# Altium project USB DV Stick 1V1.PrjPCB
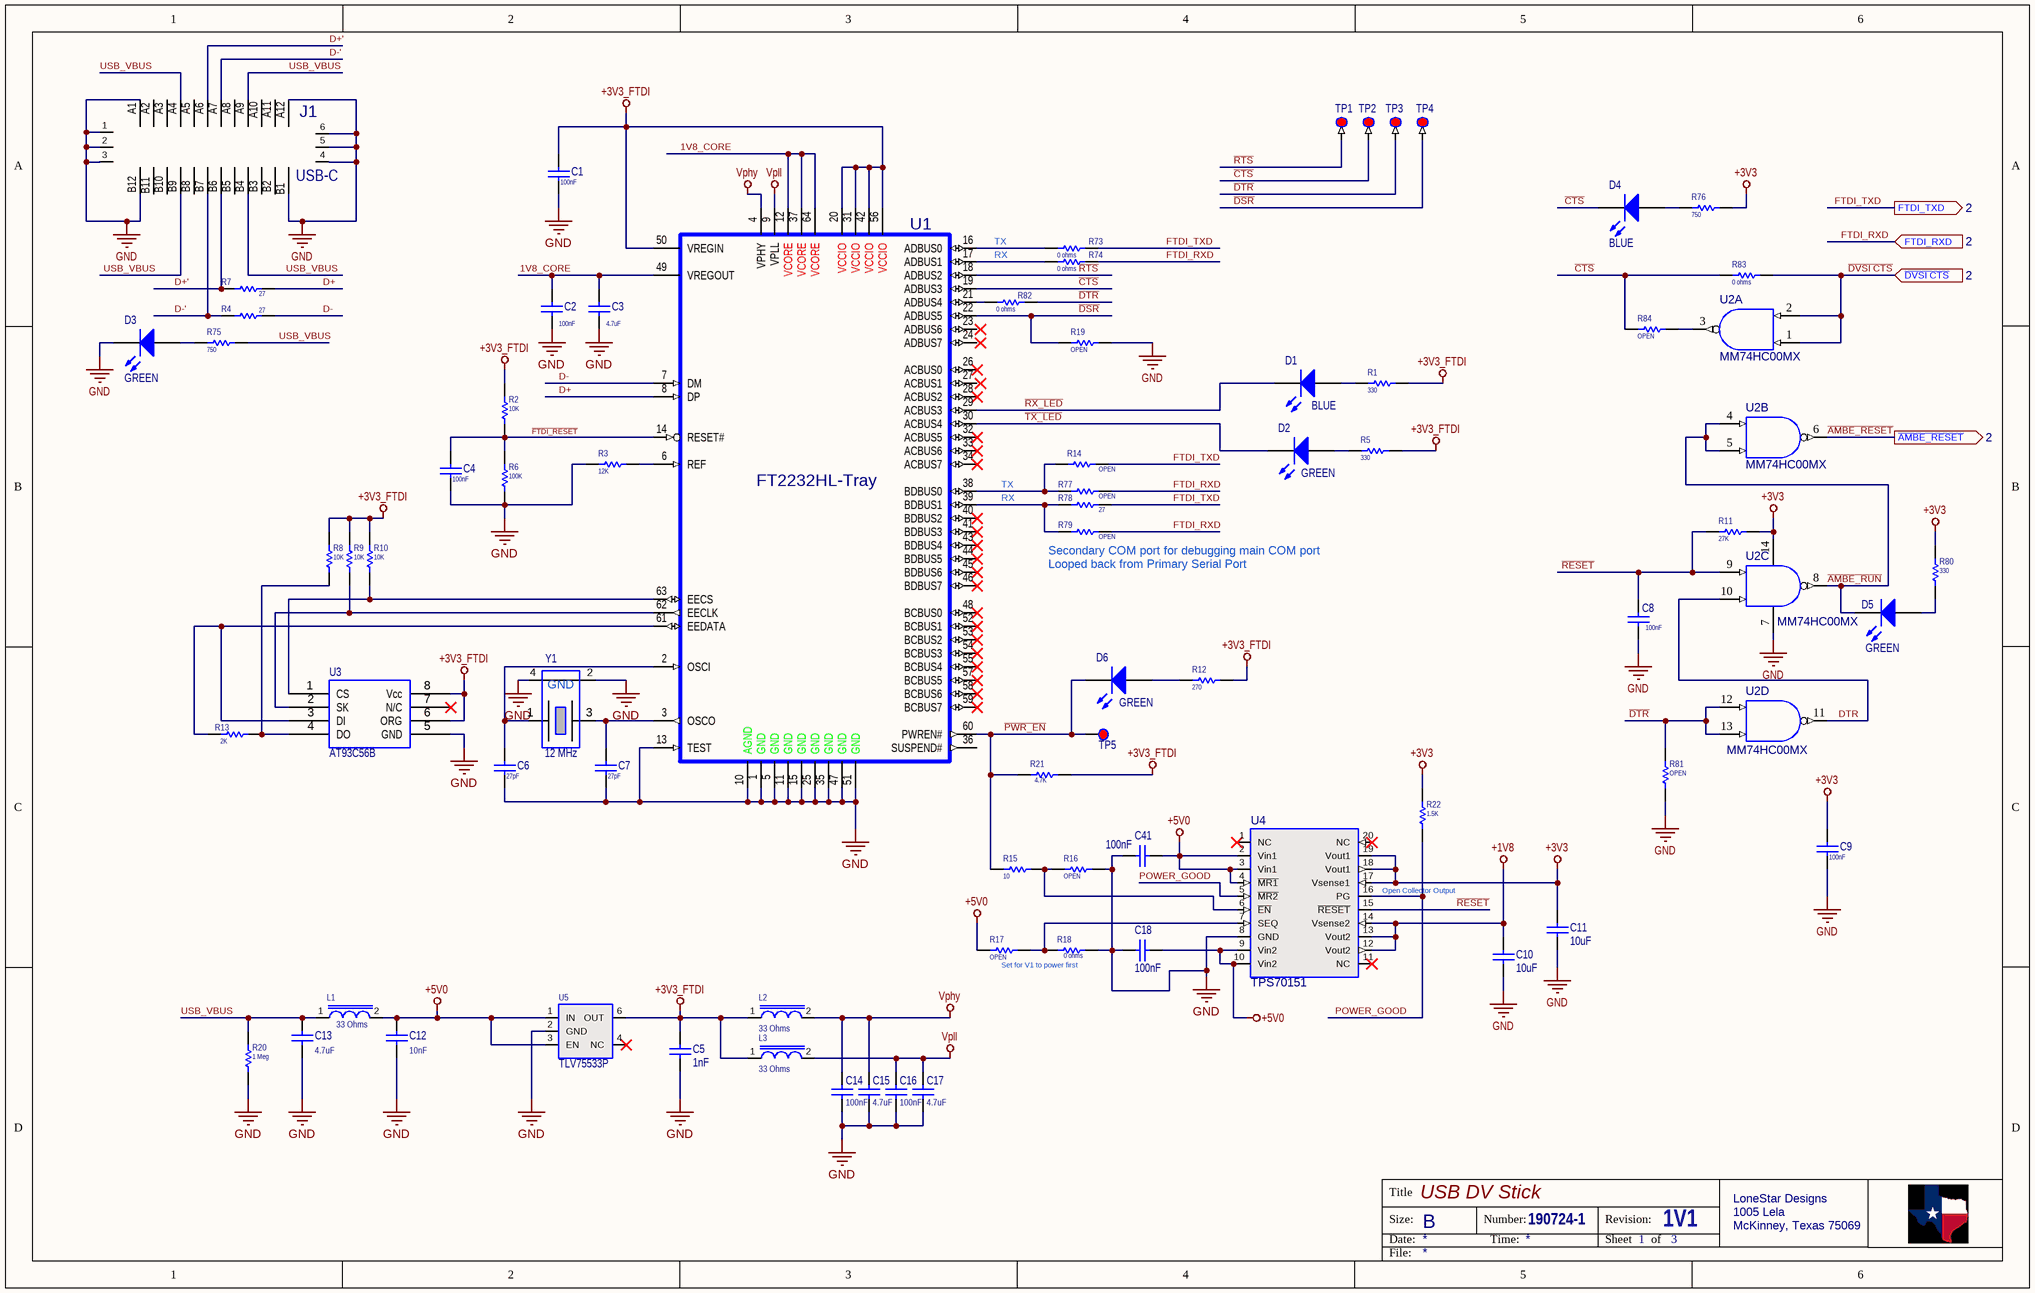
[diagram p0: USB DV Stick 1V1_Sheet1.SchDoc]
3 sheets, 158 parts. Net scope: global (net labels, ports and power ports of the same name join across sheets).
Board file: USB DV Stick 1V1.PcbDoc
Sheets:
  USB DV Stick 1V1_Sheet1.SchDoc
  USB DV Stick 1V1_Sheet2.SchDoc
  USB DV Stick 1V1_Sheet3.SchDoc

## Sheet USB DV Stick 1V1_Sheet1.SchDoc: USB DV Stick
size B; CompanyName: LoneStar Designs; Organization: LoneStar Designs; Address1: 1005 Lela; Address2: McKinney, Texas 75069; DocumentNumber: 190724-1; Revision: 1V1; SheetNumber: 1; SheetTotal: 3

### Parts
C1  100nF  [C0402]
C2  100nF  [C0402]
C3  4.7uF  [C0603]
C4  100nF  [C0402]
C5  1nF  [C0402]
C6  27pF  [C0402]
C7  27pF  [C0402]
C8  100nF  [C0402]
C9  100nF  [C0402]
C10  10uF  [C0805]
C11  10uF  [C0805]
C12  10nF  [C0402]
C13  4.7uF  [C0603]
C14  100nF  [C0402]
C15  4.7uF  [C0603]
C16  100nF  [C0402]
C17  4.7uF  [C0603]
C18  100nF  [C0402]
C41  100nF  [C0603]
D1  BLUE  [LED0603]
D2  GREEN  [LED0603]
D3  GREEN  [LED0603]
D4  BLUE  [LED0603]
D5  GREEN  [LED0603]
D6  GREEN  [LED0603]
J1  USB-C  [USB-C]
L1  33 Ohms  [C0603]
L2  33 Ohms  [C0603]
L3  33 Ohms  [C0603]
R1  330  [R0603]
R2  10K  [R0603]
R3  12K  [R0603]
R4  27  [R0603]
R5  330  [R0603]
R6  100K  [R0603]
R7  27  [R0603]
R8  10K  [R0603]
R9  10K  [R0603]
R10  10K  [R0603]
R11  27K  [R0603]
R12  270  [R0603]
R13  2K  [R0603]
R14  OPEN  [R0603]
R15  10  [R0603]
R16  OPEN  [R0603]
R17  OPEN  [R0603]
R18  0 ohms  [R0603]
R19  OPEN  [R0603]
R20  1 Meg  [R0603]
R21  4.7K  [R0603]
R22  1.5K  [R0603]
R73  0 ohms  [R0603]
R74  0 ohms  [R0603]
R75  750  [R0603]
R76  750  [R0603]
R77  OPEN  [R0603]
R78  27  [R0603]
R79  OPEN  [R0603]
R80  330  [R0603]
R81  OPEN  [R0603]
R82  0 ohms  [R0603]
R83  0 ohms  [R0603]
R84  OPEN  [R0603]
TP1  5015  [TP SM]  (value not drawn)
TP2  5015  [TP SM]  (value not drawn)
TP3  5015  [TP SM]  (value not drawn)
TP4  5015  [TP SM]  (value not drawn)
TP5  5015  [TP SM]  (value not drawn)
U1  FT2232HL-Tray  [FT2232HL]
U2  MM74HC00MX  [D014_L]  (parts A,B,C,D of 4)
U3  AT93C56B  [SO8_M]
U4  TPS70151  [TTSOP-20 (PW)]
U5  TLV75533P  [SOT23-6_M]
Y1  12 MHz  [OSC_ECS-TXO-2033]  (value not drawn)

### Ports
FTDI_RXD (in, see 2), FTDI_TXD (out, see 2), ~{AMBE_RESET} (out, see 2), ~{DVSI CTS} (in, see 2)

### Nets
+1V8: C10.2 U4.12(Vout2) U4.13(Vout2) U4.14(Vsense2)
+3V3: C9.2 C11.2 R11.1 R22.2 R76.2 R80.2 U2.14(VCC) U4.17(Vsense1) U4.18(Vout1) U4.19(Vout1)
+3V3_FTDI: C1.2 C5.2 L2.1 L3.1 R1.2 R2.2 R5.2 R8.2 R9.2 R10.2 R12.2 R21.1 U1.20(VCCIO) U1.31(VCCIO) U1.42(VCCIO) U1.50(VREGIN) U1.56(VCCIO) U3.6(ORG) U3.8(Vcc) U5.6(OUT)
+5V0: C12.2 C18.1 C41.2 L1.2 R17.1 U4.2(Vin1) U4.3(Vin1) U4.4(~{MR1}) U4.9(Vin2) U4.10(Vin2) U5.1(IN) U5.3(EN)
GND: C1.1 C2.1 C3.1 C4.1 C5.1 C6.1 C7.1 C8.1 C9.1 C10.1 C11.1 C12.1 C13.1 C14.1 C15.1 C16.1 C17.1 C18.2 C41.1 D3.2(K) J1.1 J1.2 J1.3 J1.4 J1.5 J1.6 J1.A1 J1.A12 J1.B1 J1.B12 R3.1 R6.1 R16.2 R18.2 R19.1 R20.1 R81.1 U1.1(GND) U1.5(GND) U1.10(AGND) U1.11(GND) U1.13(TEST) U1.15(GND) U1.25(GND) U1.35(GND) U1.47(GND) U1.51(GND) U2.7(GND) U3.5(GND) U4.8(GND) U5.2(GND) Y1.2(GND) Y1.4
Vphy: C14.2 C15.2 L2.2 U1.4(VPHY)
Vpll: C16.2 C17.2 L3.2 U1.9(VPLL)
1V8_CORE: C2.2 C3.2 U1.12(VCORE) U1.37(VCORE) U1.49(VREGOUT) U1.64(VCORE)
~{AMBE_RESET}: U2.6(Y) ; port ~{AMBE_RESET}
~{AMBE_RUN}: D5.2(K) U2.4(A) U2.5(B) U2.8(Y)
~{CTS}: D4.2(K) R83.1 R84.1 TP2.1 U1.19(ADBUS3)
~{DSR}: R19.2 TP4.1 U1.22(ADBUS5)
~{DTR}: R81.2 R82.2 TP3.1 U2.12(A) U2.13(B)
~{DVSI CTS}: R83.2 U2.1(A) U2.2(B) ; port ~{DVSI CTS}
~{FTDI_RESET}: C4.2 R2.1 R6.2 U1.14(RESET#)
~{PWR_EN}: D6.2(K) R15.1 R21.2 TP5.1 U1.60(PWREN#)
~{RESET}: C8.2 R11.2 U2.9(A) U4.15(~{RESET})
~{RTS}: TP1.1 U1.18(ADBUS2)
~{RX_LED}: D1.2(K) U1.29(ACBUS3)
~{TX_LED}: D2.2(K) U1.30(ACBUS4)
D+: R7.2 U1.8(DP)
D+': J1.A6 J1.B6 R7.1
D-: R4.2 U1.7(DM)
D-': J1.A7 J1.B7 R4.1
DTR: U2.10(B) U2.11(Y)
FTDI_RXD: R74.2 R77.2 R79.2 ; port FTDI_RXD
FTDI_TXD: R14.1 R73.2 R78.2 ; port FTDI_TXD
POWER_GOOD: R22.1 U4.5(~{MR2}) U4.16(PG)
USB_VBUS: C13.2 J1.A4 J1.A9 J1.B4 J1.B9 L1.1 R20.2 R75.2
NetC6_2: C6.2 U1.2(OSCI) Y1.1
NetC7_2: C7.2 U1.3(OSCO) Y1.3
NetD1_1: D1.1(A) R1.1
NetD2_1: D2.1(A) R5.1
NetD3_1: D3.1(A) R75.1
NetD4_1: D4.1(A) R76.1
NetD5_1: D5.1(A) R80.1
NetD6_1: D6.1(A) R12.1
NetR3_2: R3.2 U1.6(REF)
NetR8_1: R8.1 R13.2 U3.4(DO)
NetR9_1: R9.1 U1.62(EECLK) U3.2(SK)
NetR10_1: R10.1 U1.63(EECS) U3.1(CS)
NetR13_1: R13.1 U1.61(EEDATA) U3.3(DI)
NetR14_2: R14.2 R77.1 U1.38(BDBUS0)
NetR15_2: R15.2 R16.1 U4.6(~{EN})
NetR17_2: R17.2 R18.1 U4.7(SEQ)
NetR73_1: R73.1 U1.16(ADBUS0)
NetR74_1: R74.1 U1.17(ADBUS1)
NetR78_1: R78.1 R79.1 U1.39(BDBUS1)
NetR82_1: R82.1 U1.21(ADBUS4)
NetR84_2: R84.2 U2.3(Y)

Not connected (* = marked no-connect by the designer): J1 A2 A3 A5 A8 A10 A11 B2 B3 B5 B8 B10 B11; U1 23(ADBUS6) 24(ADBUS7) 26(ACBUS0)* 27(ACBUS1) 28(ACBUS2)* 32(ACBUS5)* 33(ACBUS6)* 34(ACBUS7)* 36(SUSPEND#) 40(BDBUS2)* 41(BDBUS3)* 43(BDBUS4)* 44(BDBUS5)* 45(BDBUS6)* 46(BDBUS7)* 48(BCBUS0)* 52(BCBUS1)* 53(BCBUS2)* 54(BCBUS3)* 55(BCBUS4)* 57(BCBUS5)* 58(BCBUS6)* 59(BCBUS7)*; U3 7(N/C)*; U4 1(NC)* 11(NC)* 20(NC)*; U5 4(NC)*

### Notes on the sheet
- TX
- RX
- (near R79) Secondary COM port for debugging main COM port
- (near R79) Looped back from Primary Serial Port
- (near U4) Open Collector Output
- Set for V1 to power first
- Title
- Size:
- Date:
- B
- Number:
- Time:
- Revision:
- Sheet
- of
- File:

### Library data of the parts
C1 C2 C4 C8 C9 C14 C16 C18 = Cap SM: Capacitor Surface Mount; Manufacturer: Murata Electronics; Manufacturer Part Number: GRM155R61H104KE19D; PackageReference: C0603; PackageDescription: Chip Capacitor; Value: 100nF; Supplier 1: Mouser; Supplier Part Number 1: 81-GRM155R61H104KE9D
C3 C13 C15 C17 = Cap SM: Capacitor Surface Mount; Manufacturer: Taiyo Yuden; Manufacturer Part Number: TMK107BBJ475MA-T; PackageReference: C0603; PackageDescription: Chip Capacitor; Value: 4.7uF; Supplier 1: Mouser; Supplier Part Number 1: 963-TMK107BBJ475MA-T
C5 = Cap SM: Capacitor Surface Mount; Manufacturer: Murata Electronics; Manufacturer Part Number: GCM1555C1H102JA16J; PackageReference: C0402; PackageDescription: Chip Capacitor; Value: 1nF; Supplier 1: Mouser; Supplier Part Number 1: 81-GCM1555C1H102JA6J
C6 C7 = Cap SM: Capacitor Surface Mount; Manufacturer: Murata Electronics; Manufacturer Part Number: GCM1555C1H270FA16D; PackageReference: C0603; PackageDescription: Chip Capacitor; Value: 27pF; Supplier 1: Mouser; Supplier Part Number 1: 81-GCM1555C1H270FA6D
C10 C11 = Cap SM: Capacitor Surface Mount; Manufacturer: Murata Electronics; Manufacturer Part Number: GRJ21BR61E106KE01K; PackageReference: C0603; PackageDescription: Chip Capacitor; Value: 10uF; Supplier 1: Mouser; Supplier Part Number 1: 81-GRJ21BR61E106KE1K
C12 = Cap SM: Capacitor Surface Mount; Manufacturer: Murata Electronics; Manufacturer Part Number: GCM155R71H103KA55D; PackageReference: C0402; PackageDescription: Chip Capacitor; Value: 10nF; Supplier 1: Mouser; Supplier Part Number 1: 81-GCM155R71H103KA5D
C41 = Cap SM: Capacitor Surface Mount; Manufacturer: Murata Electronics; Manufacturer Part Number: GRM033C71C104KE14D; LatestRevisionDate: 08/13/2019; LatestRevisionNote: IPC-7351 Footprint Added.; PackageReference: C0603; PackageDescription: Chip Capacitor; Value: 100nF; Supplier 1: Mouser; Supplier 1 Part Number: *; Supplier Part Number 1: 81-GRM33C71C104KE14D
D1 D4 = LED 0603 BLUE: BLUE in 0603 package; Manufacturer: Kingbright; Manufacturer Part Number: APT1608QBC/D; PackageDescription: SM LED; 0603 package; Supplier 1: Mouser; Supplier Part Number 1: 604-APT1608QBC/D; Value: BLUE; PackageReference: R0603
D2 D3 D5 D6 = LED 0603 GREEN: GREEN in 0603 package; Manufacturer: Kingbright; Manufacturer Part Number: APT1608CGCK; PackageDescription: SM LED; 0603 package; Supplier 1: Mouser; Supplier Part Number 1: 604-APT1608CGCK; Value: GREEN; PackageReference: R0603
J1 = USB-C ( through hole ): USB Type C with through holes; Manufacturer: Würth Elektronik; Manufacturer Part Number: 632 723 300 311; Supplier 1: Mouser; Supplier Part Number 1: 710-632723300011; Value: USB-C; PackageDescription: USB-C; PackageReference: USB-C
L1-L3 = Ferrite Bead ( 0603 ): Standard Ferrite Bead in 0603 package; Manufacturer: Taiyo Yuden; Manufacturer Part Number: BKP1608HS121-T; Value: 33 Ohms; Supplier 1: Mouser; Supplier Part Number 1: 963-BKP1608HS121-T; PackageDescription: Ferrite Bead; PackageReference: C0603
R1 R5 R80 = RES SM: Resistor Surface Mount; Manufacturer: Vishay / Dale; Manufacturer Part Number: CRCW0603330RFKEBC; PackageReference: R0603; PackageDescription: Surface Mount; Value: 330; Supplier 1: Mouser; Supplier Part Number 1: 71-CRCW0603330RFKEBC
R2 R8-R10 = RES SM: Resistor Surface Mount; Manufacturer: Vishay / Dale; Manufacturer Part Number: CRCW060310K0FKEAC; PackageReference: R0603; PackageDescription: Surface Mount; Value: 10K; Supplier 1: Mouser; Supplier Part Number 1: 71-CRCW060310K0FKEAC
R3 = RES SM: Resistor Surface Mount; Manufacturer: Vishay / Dale; Manufacturer Part Number: CRCW060312K1FKEAC; PackageReference: R0603; PackageDescription: Surface Mount; Value: 12K; Supplier 1: Mouser; Supplier Part Number 1: 71-CRCW060312K1FKEAC
R4 R7 R78 = RES SM: Resistor Surface Mount; Manufacturer: Vishay / Dale; Manufacturer Part Number: RCS060327R0FKEA; PackageReference: R0603; PackageDescription: Surface Mount; Value: 27; Supplier 1: Mouser; Supplier Part Number 1: 71-RCS060327R0FKEA
R6 = RES SM: Resistor Surface Mount; Manufacturer: Vishay / Dale; Manufacturer Part Number: CRCW0603100KJNEAC; PackageReference: R0603; PackageDescription: Surface Mount; Value: 100K; Supplier 1: Mouser; Supplier Part Number 1: 71-CRCW0603100KJNEAC
R11 = RES SM: Resistor Surface Mount; Manufacturer: Vishay / Dale; Manufacturer Part Number: CRCW060327K0FKEAC; PackageReference: R0603; PackageDescription: Surface Mount; Value: 27K; Supplier 1: Mouser; Supplier Part Number 1: 71-CRCW060327K0FKEAC
R12 = RES SM: Resistor Surface Mount; Manufacturer: Vishay / Dale; Manufacturer Part Number: RCS0603270RFKEA; PackageReference: R0603; PackageDescription: Surface Mount; Value: 270; Supplier 1: Mouser; Supplier Part Number 1: 71-RCS0603270RFKEA
R13 = RES SM: Resistor Surface Mount; Manufacturer: Vishay / Dale; Manufacturer Part Number: CRCW06032K00FKEAC; PackageReference: R0603; PackageDescription: Surface Mount; Value: 2K; Supplier 1: Mouser; Supplier Part Number 1: 71-CRCW06032K00FKEAC
R14 R16 R17 R19 R77 R79 R81 R84 = RES SM: Resistor Surface Mount; PackageReference: R0603; PackageDescription: Surface Mount; Value: OPEN; Manufacturer: N/A; Manufacturer Part Number: N/A; Supplier Part Number 1: N/A
  R14 R16 R17 R19 R77 R79 R81: Supplier 1: N/A
  R84: Supplier 1: Mouser
R15 = RES SM: Resistor Surface Mount; Manufacturer: Vishay / Dale; Manufacturer Part Number: CRCW060310R0FKEAC; PackageReference: R0603; PackageDescription: Surface Mount; Value: 10; Supplier 1: Mouser; Supplier Part Number 1: 71-CRCW060310R0FKEAC
R18 R73 R74 R82 R83 = RES SM: Resistor Surface Mount; Manufacturer: Vishay / Dale; Manufacturer Part Number: CRCW06030000Z0EAC; PackageReference: R0603; PackageDescription: Surface Mount; Value: 0 ohms; Supplier 1: Mouser; Supplier Part Number 1: 71-CRCW06030000Z0EAC
R20 = RES SM: Resistor Surface Mount; Manufacturer: Panasonic; Manufacturer Part Number: ERJ-3EKF1004V; PackageReference: R0603; PackageDescription: Surface Mount; Value: 1 Meg; Supplier 1: Mouser; Supplier Part Number 1: 667-ERJ-3EKF1004V
R21 = RES SM: Resistor Surface Mount; Manufacturer: Vishay / Dale; Manufacturer Part Number: CRCW06034K70FKEA; PackageReference: R0603; PackageDescription: Surface Mount; Value: 4.7K; Supplier 1: Mouser; Supplier Part Number 1: 71-CRCW0603-4.7K-E3
R22 = RES SM: Resistor Surface Mount; Manufacturer: Vishay / Dale; Manufacturer Part Number: CRCW06031K50FKEAC; PackageReference: R0603; PackageDescription: Surface Mount; Value: 1.5K; Supplier 1: Mouser; Supplier Part Number 1: 71-CRCW06031K50FKEAC
R75 R76 = RES SM: Resistor Surface Mount; Manufacturer: Vishay / Dale; Manufacturer Part Number: CRCW0603750RFKEA; PackageReference: R0603; PackageDescription: Surface Mount; Value: 750; Supplier 1: Mouser; Supplier Part Number 1: 71-CRCW0603-750-E3
TP1-TP5 = Test Point: Surface Mount; Manufacturer: Keystone; Value: TP SM; Manufacturer Part Number: 5015; Supplier 1: Mouser; Supplier 2: Digi-Key; Supplier Part Number 1: 534-5015; Supplier Part Number 2: 36-5015CT-ND; PackageDescription: R0805; PackageReference: R0805
U1 = FT2232HL-Tray: Dual High Speed USB To Multipurpose UART/FIFO IC, LQFP-64, Tray; Manufacturer: FTDI; PackageReference: LQFP-64; PackageDescription: 64-Pin Thin Quad Flat Pack, 10 x 10 x 1.4 mm Body, 0.5 mm Pitch; ComponentLink1Description: Manufacturer Link; ComponentLink1URL: http://www.ftdichip.com/Products/ICs/FT2232H.htm; ComponentLink2Description: Datasheet; Supplier 1: Mouser; Supplier 2: Digi-Key; Supplier Part Number 1: 895-FT2232HL-TRAY; Supplier Part Number 2: 768-1347-ND; Value: FT2232HL-TR; Manufacturer Part Number: FT2232HL-TRAY
U2 = 74AS00D: Quadruple 2-Input Positive-NAND Gate; Manufacturer: ON / Fairchild; PackageReference: SOIC-14 Narrow; PackageDescription: 14-Pin Small Outline Integrated Circuit 1.27 mm Pitch; ComponentLink1Description: Manufacturer Link; ComponentLink1URL: https://www.mouser.com/datasheet/2/149/MM74HC00-1011083.pdf; ComponentLink2Description: Datasheet; Value: MM74HC00MX; Supplier 1: Mouser; Manufacturer Part Number: MM74HC00MX; Supplier Part Number 1: 512-MM74HC00MX
U3 = AT93C56B: 2Kb ( 256 x 8 ) Serial Memory; Manufacturer: Microship Technology; Manufacturer Part Number: AT93C56B-SSHM-B; Supplier 1: Mouser; Supplier Part Number 1: 556-AT93C56B-SSHM-B; Value: AT93C56B; PackageDescription: SO-8; PackageReference: SO-8
U4 = TPS70151: Dual Output low drop out regulator; Manufacturer Part Number: TPS70151PWP; Manufacturer: TI; Value: TPS70151; Supplier 1: Mouser; Supplier Part Number 1: 595-TPS70151PWP; PackageDescription: HTTSOP-20; PackageReference: TTSOP-20
U5 = TLV755P: 3.3V LDO in SOT-23-5 package  ( 500mA); Manufacturer Part Number: TLV75533PDBVR; Manufacturer: TI; Value: TLV75533P; Supplier 1: Mouser; Supplier Part Number 1: 595-TLV75533PDBVR; PackageDescription: SOT23-5; PackageReference: SOT23-5
Y1 = Xtal - 4 pin ( 12 MHz ): Surface Mount Crystal  ( 2.5 x 2.0 )  4 pin; Manufacturer: ECS; Manufacturer Part Number: ECS-120-10-36B-CWY-TR; Value: 12 MHz; Supplier Part Number 1: 520-120-10-36B-CWYT; Supplier 1: Mouser; PackageDescription: Xtal (2.5 x 2.0 mm ); PackageReference: 2.5 x 2.0

## Sheet USB DV Stick 1V1_Sheet2.SchDoc: USB DV STICK
size B; CompanyName: LoneStar Designs; Organization: LoneStar Designs; Address1: 1005 Lela St; Address2: McKinney, Texas 75069; DocumentNumber: 190724-1; Revision: 1V1; SheetNumber: 2; SheetTotal: 3
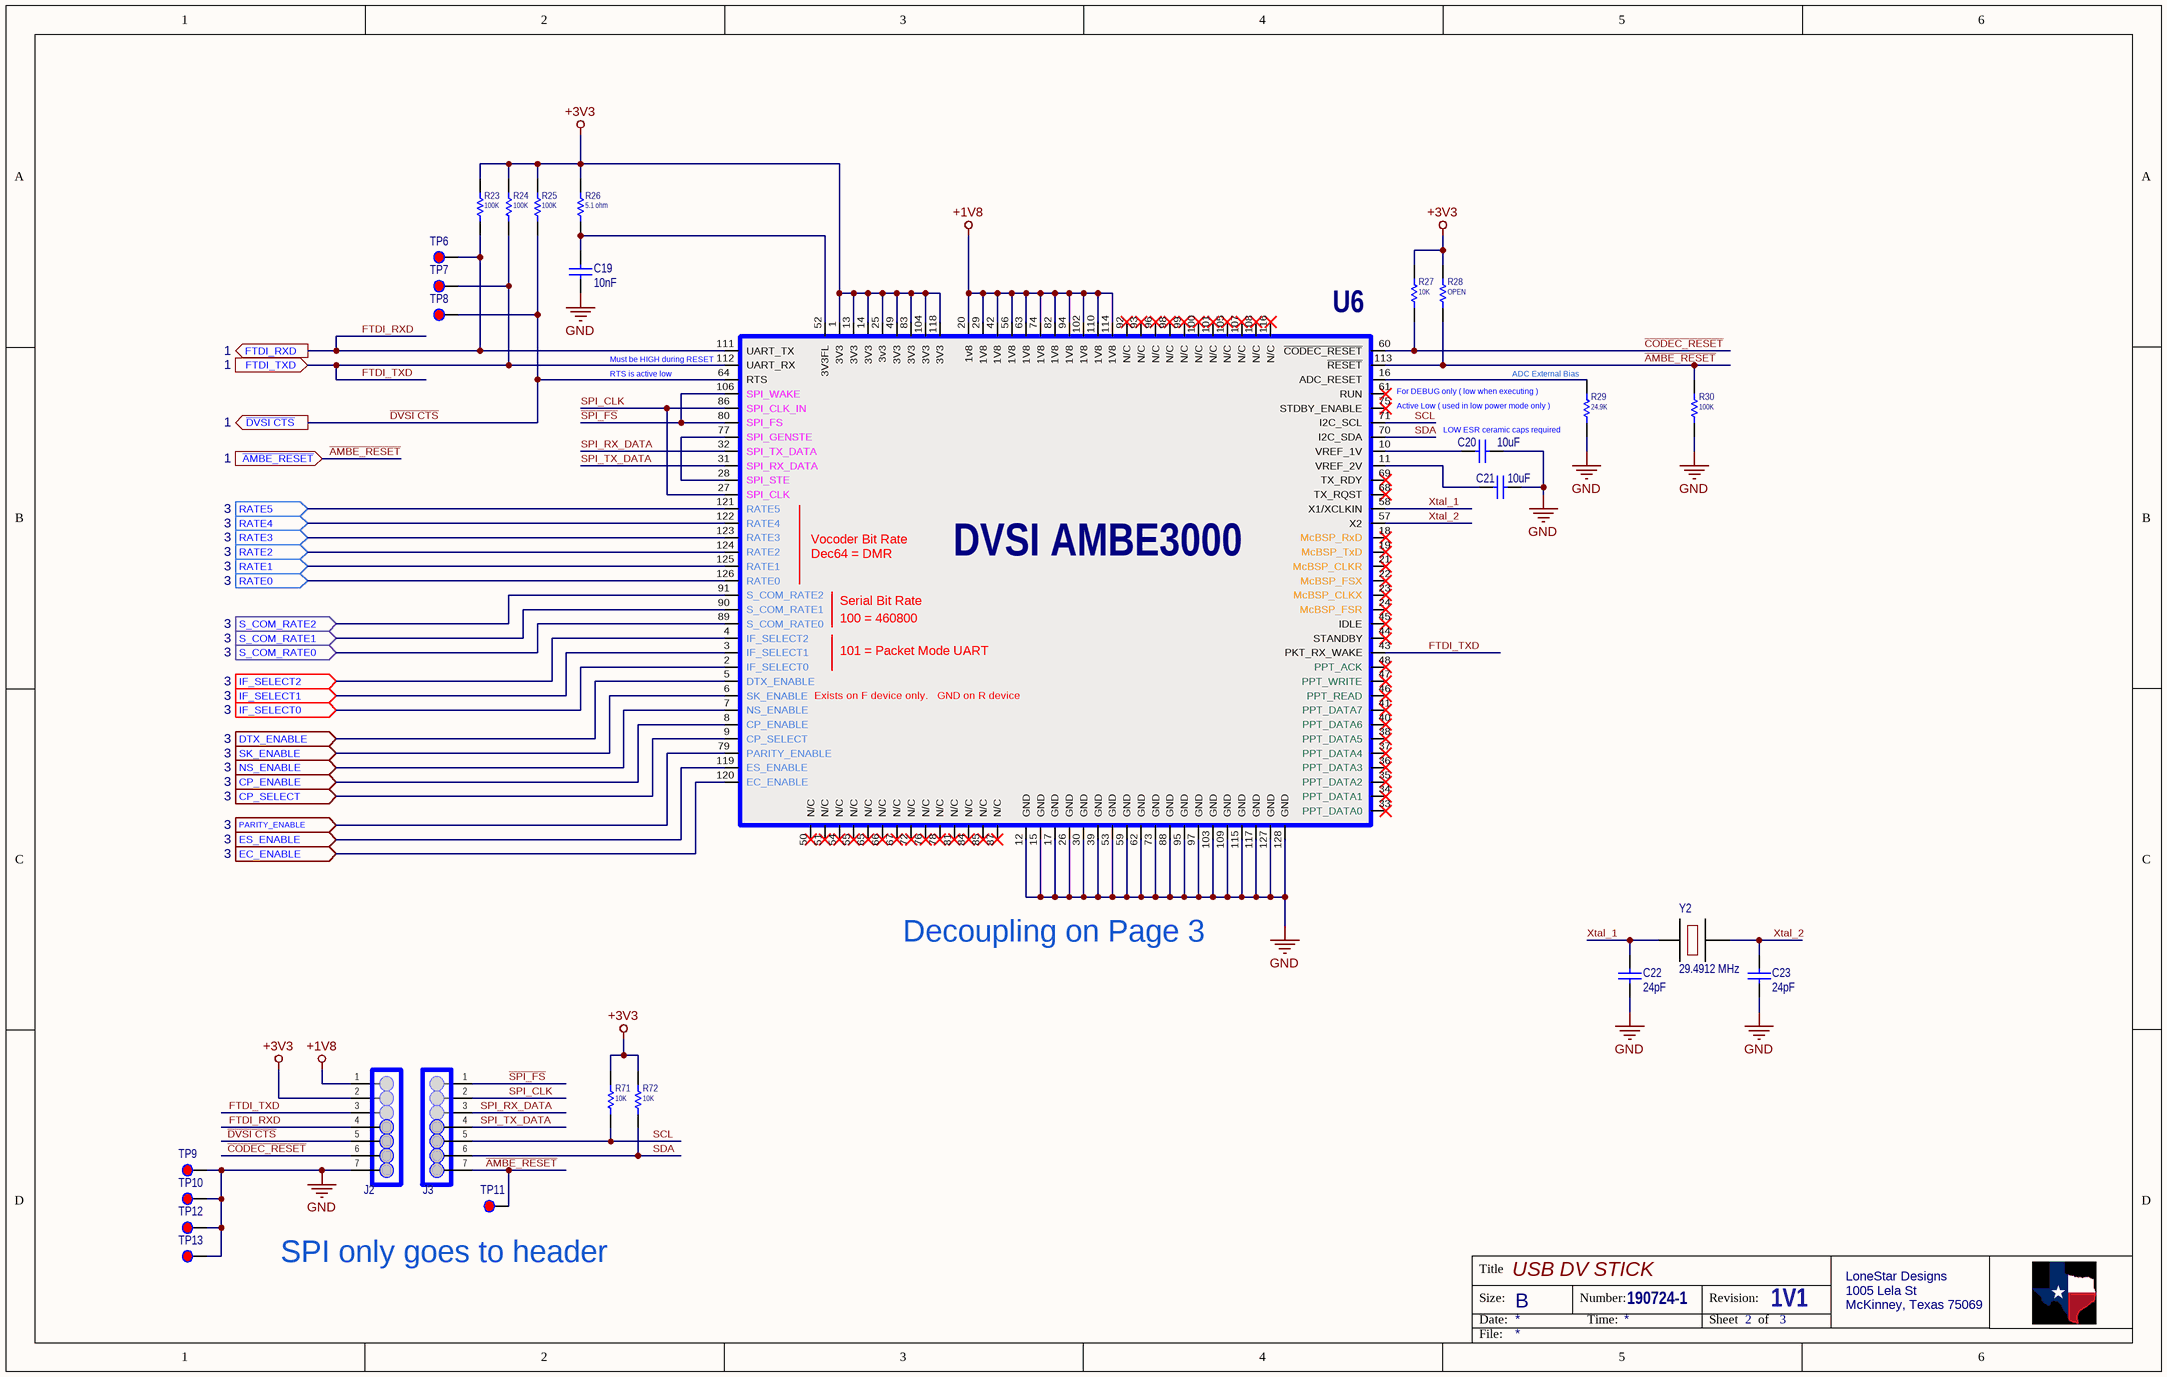
[diagram p1: USB DV Stick 1V1_Sheet2.SchDoc]

### Parts
C19  10nF  [C0402]
C20  10uF  [C0805]
C21  10uF  [C0805]
C22  24pF  [C0402]
C23  24pF  [C0402]
J2  7x1 on 0.1" centers  [HDR1x7]  (value not drawn)
J3  7x1 on 0.1" centers  [HDR1x7]  (value not drawn)
R23  100K  [R0603]
R24  100K  [R0603]
R25  100K  [R0603]
R26  5.1 ohm  [R0603]
R27  10K  [R0603]
R28  OPEN  [R0603]
R29  24.9K  [R0603]
R30  100K  [R0603]
R71  10K  [R0402]
R72  10K  [R0402]
TP6  5015  [TP SM]  (value not drawn)
TP7  5015  [TP SM]  (value not drawn)
TP8  5015  [TP SM]  (value not drawn)
TP9  5015  [TP SM]  (value not drawn)
TP10  5015  [TP SM]  (value not drawn)
TP11  5015  [TP SM]  (value not drawn)
TP12  5015  [TP SM]  (value not drawn)
TP13  5015  [TP SM]  (value not drawn)
U6  DVSI AMBE3000  [LQFP-128]
Y2  29.4912 MHz  [Xtal 5.0x3.2]

### Ports
CP_ENABLE (in, see 3), CP_SELECT (in, see 3), DTX_ENABLE (in, see 3), EC_ENABLE (in, see 3), ES_ENABLE (in, see 3), FTDI_RXD (out, see 1), FTDI_TXD (in, see 1), IF_SELECT0 (in, see 3), IF_SELECT1 (in, see 3), IF_SELECT2 (in, see 3), NS_ENABLE (in, see 3), PARITY_ENABLE (in, see 3), RATE0 (in, see 3), RATE1 (in, see 3), RATE2 (in, see 3), RATE3 (in, see 3), RATE4 (in, see 3), RATE5 (in, see 3), S_COM_RATE0 (in, see 3), S_COM_RATE1 (in, see 3), S_COM_RATE2 (in, see 3), SK_ENABLE (in, see 3), ~{AMBE_RESET} (in, see 1), ~{DVSI CTS} (out, see 1)

### Nets
+1V8: J2.1 U6.20(1v8) U6.29(1V8) U6.42(1V8) U6.56(1V8) U6.63(1V8) U6.74(1V8) U6.82(1V8) U6.94(1V8) U6.102(1V8) U6.110(1V8) U6.114(1V8)
+3V3: J2.2 R23.2 R24.2 R25.2 R26.2 R27.2 R28.2 R71.2 R72.2 U6.1(3V3) U6.13(3V3) U6.14(3V3) U6.25(3v3) U6.49(3V3) U6.83(3V3) U6.104(3V3) U6.118(3V3)
GND: C19.1 C20.2 C21.2 C22.1 C23.1 J2.7 R29.1 R30.1 TP9.1 TP10.1 TP12.1 TP13.1 U6.12(GND) U6.15(GND) U6.17(GND) U6.26(GND) U6.30(GND) U6.39(GND) U6.53(GND) U6.59(GND) U6.62(GND) U6.73(GND) U6.88(GND) U6.95(GND) U6.97(GND) U6.103(GND) U6.109(GND) U6.115(GND) U6.117(GND) U6.127(GND) U6.128(GND)
~{AMBE_RESET}: J3.7 R28.1 R30.2 TP11.1 U6.113(~{RESET}) ; port ~{AMBE_RESET}
~{CODEC_RESET}: J2.6 R27.1 U6.60(~{CODEC_RESET})
~{DVSI CTS}: J2.5 R25.1 TP8.1 U6.64(RTS) ; port ~{DVSI CTS}
~{SPI_FS}: J3.1 U6.80(SPI_FS) U6.106(SPI_WAKE)
CP_ENABLE: U6.8(CP_ENABLE) ; port CP_ENABLE
CP_SELECT: U6.9(CP_SELECT) ; port CP_SELECT
DTX_ENABLE: U6.5(DTX_ENABLE) ; port DTX_ENABLE
EC_ENABLE: U6.120(EC_ENABLE) ; port EC_ENABLE
ES_ENABLE: U6.119(ES_ENABLE) ; port ES_ENABLE
FTDI_RXD: J2.4 R23.1 TP6.1 U6.111(UART_TX) ; port FTDI_RXD
FTDI_TXD: J2.3 R24.1 TP7.1 U6.43(PKT_RX_WAKE) U6.112(UART_RX) ; port FTDI_TXD
IF_SELECT0: U6.2(IF_SELECT0) ; port IF_SELECT0
IF_SELECT1: U6.3(IF_SELECT1) ; port IF_SELECT1
IF_SELECT2: U6.4(IF_SELECT2) ; port IF_SELECT2
NS_ENABLE: U6.7(NS_ENABLE) ; port NS_ENABLE
PARITY_ENABLE: U6.79(PARITY_ENABLE) ; port PARITY_ENABLE
RATE0: U6.126(RATE0) ; port RATE0
RATE1: U6.125(RATE1) ; port RATE1
RATE2: U6.124(RATE2) ; port RATE2
RATE3: U6.123(RATE3) ; port RATE3
RATE4: U6.122(RATE4) ; port RATE4
RATE5: U6.121(RATE5) ; port RATE5
S_COM_RATE0: U6.89(S_COM_RATE0) ; port S_COM_RATE0
S_COM_RATE1: U6.90(S_COM_RATE1) ; port S_COM_RATE1
S_COM_RATE2: U6.91(S_COM_RATE2) ; port S_COM_RATE2
SCL: J3.5 R71.1 U6.71(I2C_SCL)
SDA: J3.6 R72.1 U6.70(I2C_SDA)
SK_ENABLE: U6.6(SK_ENABLE) ; port SK_ENABLE
SPI_CLK: J3.2 U6.27(SPI_CLK) U6.86(SPI_CLK_IN)
SPI_RX_DATA: J3.3 U6.32(SPI_TX_DATA)
SPI_TX_DATA: J3.4 U6.31(SPI_RX_DATA)
Xtal_1: C22.2 U6.58(X1/XCLKIN) Y2.1
Xtal_2: C23.2 U6.57(X2) Y2.2
NetC19_2: C19.2 R26.1 U6.52(3V3FL)
NetC20_1: C20.1 U6.10(VREF_1V)
NetC21_1: C21.1 U6.11(VREF_2V)
NetR29_2: R29.2 U6.16(ADC_RESET)
NetU6_28: U6.28(SPI_STE) U6.77(SPI_GENSTE)

Not connected (* = marked no-connect by the designer): U6 18(McBSP_RxD)* 19(McBSP_TxD)* 21(McBSP_CLKR)* 22(McBSP_FSX)* 23(McBSP_CLKX)* 24(McBSP_FSR)* 33(PPT_DATA0)* 34(PPT_DATA1)* 35(PPT_DATA2)* 36(PPT_DATA3)* 37(PPT_DATA4)* 38(PPT_DATA5)* 40(PPT_DATA6)* 41(PPT_DATA7)* 44(STANDBY)* 45(IDLE)* 46(PPT_READ)* 47(PPT_WRITE)* 48(PPT_ACK)* 50(N/C)* 51(N/C)* 54(N/C)* 55(N/C)* 61(RUN)* 65(N/C)* 66(N/C)* 67(N/C)* 68(TX_RQST)* 69(TX_RDY)* 72(N/C)* 75(STDBY_ENABLE)* 76(N/C)* 78(N/C)* 81(N/C)* 84(N/C)* 85(N/C)* 87(N/C)* 92(N/C)* 93(N/C)* 96(N/C)* 98(N/C)* 99(N/C)* 100(N/C)* 101(N/C)* 105(N/C)* 107(N/C)* 108(N/C)* 116(N/C)*

### Notes on the sheet
- RTS is active low
- (near U6) Must be HIGH during RESET
- (near U6) For DEBUG only ( low when executing )
- (near R29) ADC External Bias
- Active Low ( used in low power mode only )
- (near C20) LOW ESR ceramic caps required
- (near U6) Vocoder Bit Rate
- (near U6) Dec64 = DMR
- (near U6) Serial Bit Rate
- (near U6) 101 = Packet Mode UART
- (near U6) 100 = 460800
- (near U6) Exists on F device only.   GND on R device
- Decoupling on Page 3
- (near TP11) SPI only goes to header
- Title
- Size:
- Date:
- B
- Number:
- Time:
- Revision:
- Sheet
- of
- File:

### Library data of the parts
C19 = Cap SM: as C12 on sheet USB DV Stick 1V1_Sheet1; PackageReference: C0402; PackageDescription: Chip Capacitor; Value: 10nF; Supplier 1: Mouser; Supplier Part Number 1: 81-GCM155R71H103KA5D
C20 C21 = Cap SM: as C10 on sheet USB DV Stick 1V1_Sheet1; PackageReference: C0603; PackageDescription: Chip Capacitor; Value: 10uF; Supplier 1: Mouser; Supplier Part Number 1: 81-GRJ21BR61E106KE1K
C22 C23 = Cap SM: Capacitor Surface Mount; Manufacturer: Murata Electronics; Manufacturer Part Number: GCQ1555C1H240FB01D; PackageReference: C0603; PackageDescription: Chip Capacitor; Value: 24pF; Supplier 1: Mouser; Supplier Part Number 1: 81-GCQ1555C1H240FB1D
J2 J3 = 7x1 Pin Header: Supplier 1: N/A; Value: 7x1; PackageDescription: Through Hole; PackageReference: SIP; Manufacturer: N/A; Manufacturer Part Number: N/A; Supplier Part Number 1: N/A
R23-R25 R30 = RES SM: as R6 on sheet USB DV Stick 1V1_Sheet1; PackageReference: R0603; PackageDescription: Surface Mount; Value: 100K; Supplier 1: Mouser; Supplier Part Number 1: 71-CRCW0603100KJNEAC
R26 = RES SM: Resistor Surface Mount; Manufacturer: Vishay / Dale; Manufacturer Part Number: RCS06035R10FKEA; PackageReference: R0603; PackageDescription: Surface Mount; Value: 5.1 ohm; Supplier 1: Mouser; Supplier Part Number 1: 71-RCS06035R10FKEA
R27 R71 R72 = RES SM: as R2 on sheet USB DV Stick 1V1_Sheet1; PackageReference: R0603; PackageDescription: Surface Mount; Value: 10K; Supplier 1: Mouser; Supplier Part Number 1: 71-CRCW060310K0FKEAC
R28 = RES SM: Resistor Surface Mount; PackageReference: R0603; PackageDescription: Surface Mount; Value: OPEN; Supplier 1: N/A; Manufacturer: N/A; Supplier Part Number 1: N/A; Manufacturer Part Number: N/A
R29 = RES SM: Resistor Surface Mount; Manufacturer: Vishay / Dale; Manufacturer Part Number: CRCW060324K9FKEA; PackageReference: R0603; PackageDescription: Surface Mount; Value: 24.9K; Supplier 1: Mouser; Supplier Part Number 1: 71-CRCW0603-24.9K-E3
TP6-TP13 = Test Point: as TP1 on sheet USB DV Stick 1V1_Sheet1; Manufacturer Part Number: 5015; Supplier 1: Mouser; Supplier 2: Digi-Key; Supplier Part Number 1: 534-5015; Supplier Part Number 2: 36-5015CT-ND; PackageDescription: R0805; PackageReference: R0805
U6 = AMBE3000F_Pin_Modified: AMBE vocoder ( Logical Pin Order ); Manufacturer Part Number: AMBE3000R; Value: AMBE3000R; Supplier 1: DVSI; Supplier Part Number 1: AMBE3000R; Manufacturer: DVSI; PackageDescription: 128 PIN LQFP
Y2 = Xtal: Surface Mount Crystal  ( 5.0 x 3.2 ); Manufacturer Part Number: ABM3-29.4912MHZ-B4Y-T; Manufacturer: ABRACON; Value: 29.4912 MHz; Supplier 1: Mouser; Supplier Part Number 1: 815-ABM3294912B4YT; PackageDescription: 5.0 x 3.2 mm; PackageReference: 5.0x3.2 mm

## Sheet USB DV Stick 1V1_Sheet3.SchDoc: USB DV stick
size B; CompanyName: LoneStar; Organization: LoneStar; Address1: 1005 Lela; Address2: McKinney, Texas 75069; DocumentNumber: 190724-1; Revision: 1V1; SheetNumber: 3; SheetTotal: 3
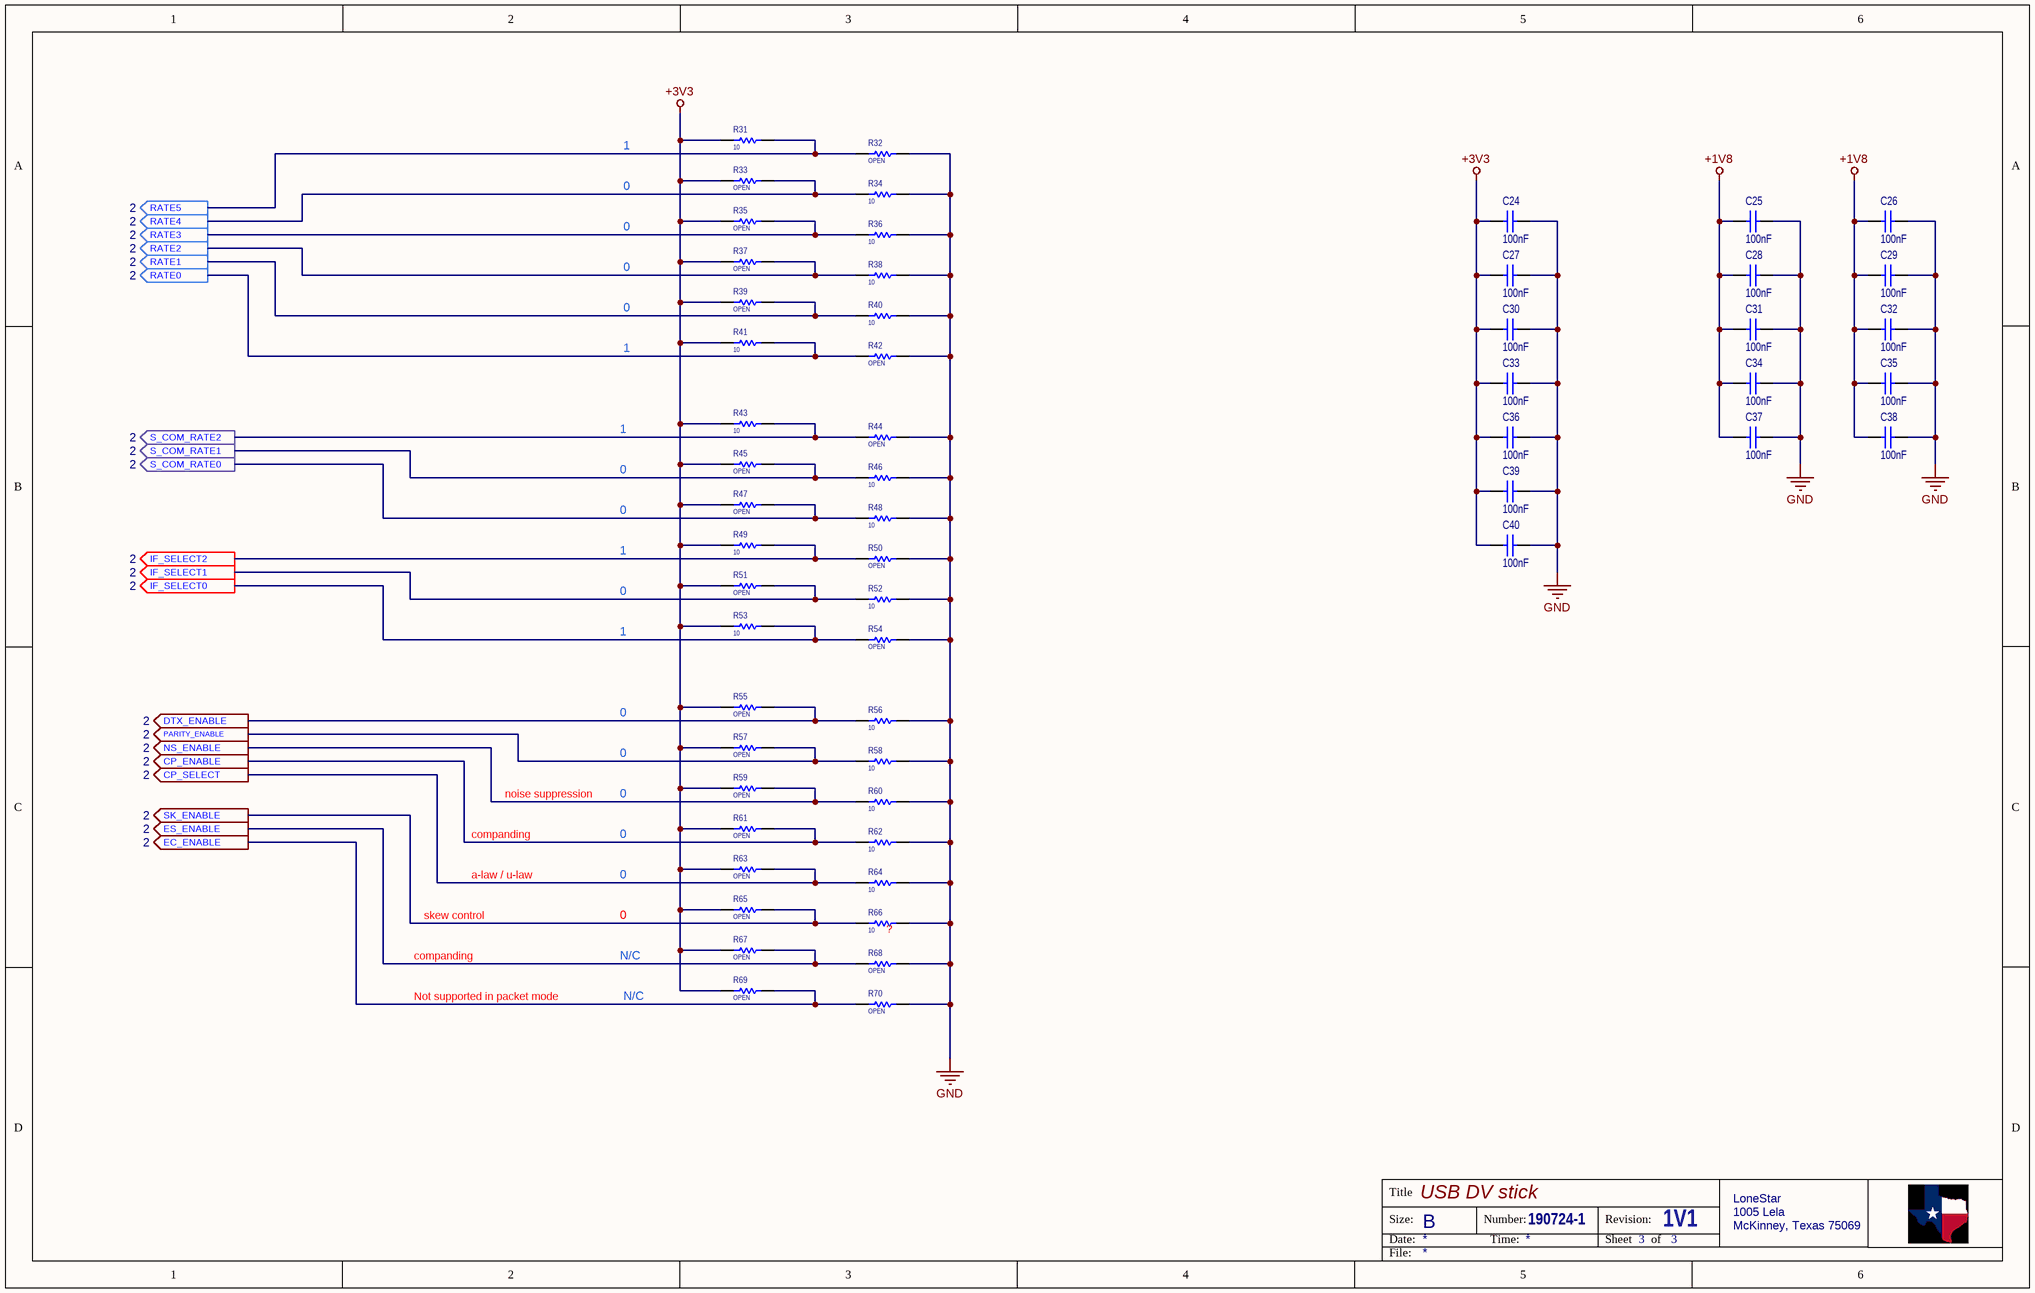
[diagram p2: USB DV Stick 1V1_Sheet3.SchDoc]

### Parts
C24  100nF  [C0402]
C25  100nF  [C0402]
C26  100nF  [C0402]
C27  100nF  [C0402]
C28  100nF  [C0402]
C29  100nF  [C0402]
C30  100nF  [C0402]
C31  100nF  [C0402]
C32  100nF  [C0402]
C33  100nF  [C0402]
C34  100nF  [C0402]
C35  100nF  [C0402]
C36  100nF  [C0402]
C37  100nF  [C0402]
C38  100nF  [C0402]
C39  100nF  [C0402]
C40  100nF  [C0402]
R31  10  [R0603]
R32  OPEN  [R0603]
R33  OPEN  [R0603]
R34  10  [R0603]
R35  OPEN  [R0603]
R36  10  [R0603]
R37  OPEN  [R0603]
R38  10  [R0603]
R39  OPEN  [R0603]
R40  10  [R0603]
R41  10  [R0603]
R42  OPEN  [R0603]
R43  10  [R0603]
R44  OPEN  [R0603]
R45  OPEN  [R0603]
R46  10  [R0603]
R47  OPEN  [R0603]
R48  10  [R0603]
R49  10  [R0603]
R50  OPEN  [R0603]
R51  OPEN  [R0603]
R52  10  [R0603]
R53  10  [R0603]
R54  OPEN  [R0603]
R55  OPEN  [R0603]
R56  10  [R0603]
R57  OPEN  [R0603]
R58  10  [R0603]
R59  OPEN  [R0603]
R60  10  [R0603]
R61  OPEN  [R0603]
R62  10  [R0603]
R63  OPEN  [R0603]
R64  10  [R0603]
R65  OPEN  [R0603]
R66  10  [R0603]
R67  OPEN  [R0603]
R68  OPEN  [R0603]
R69  OPEN  [R0603]
R70  OPEN  [R0603]

### Ports
CP_ENABLE (out, see 2), CP_SELECT (out, see 2), DTX_ENABLE (out, see 2), EC_ENABLE (out, see 2), ES_ENABLE (out, see 2), IF_SELECT0 (out, see 2), IF_SELECT1 (out, see 2), IF_SELECT2 (out, see 2), NS_ENABLE (out, see 2), PARITY_ENABLE (out, see 2), RATE0 (out, see 2), RATE1 (out, see 2), RATE2 (out, see 2), RATE3 (out, see 2), RATE4 (out, see 2), RATE5 (out, see 2), S_COM_RATE0 (out, see 2), S_COM_RATE1 (out, see 2), S_COM_RATE2 (out, see 2), SK_ENABLE (out, see 2)

### Nets
+1V8: C25.1 C26.1 C28.1 C29.1 C31.1 C32.1 C34.1 C35.1 C37.1 C38.1
+3V3: C24.1 C27.1 C30.1 C33.1 C36.1 C39.1 C40.1 R31.1 R33.1 R35.1 R37.1 R39.1 R41.1 R43.1 R45.1 R47.1 R49.1 R51.1 R53.1 R55.1 R57.1 R59.1 R61.1 R63.1 R65.1 R67.1 R69.1
GND: C24.2 C25.2 C26.2 C27.2 C28.2 C29.2 C30.2 C31.2 C32.2 C33.2 C34.2 C35.2 C36.2 C37.2 C38.2 C39.2 C40.2 R32.2 R34.2 R36.2 R38.2 R40.2 R42.2 R44.2 R46.2 R48.2 R50.2 R52.2 R54.2 R56.2 R58.2 R60.2 R62.2 R64.2 R66.2 R68.2 R70.2
CP_ENABLE: R61.2 R62.1 ; port CP_ENABLE
CP_SELECT: R63.2 R64.1 ; port CP_SELECT
DTX_ENABLE: R55.2 R56.1 ; port DTX_ENABLE
EC_ENABLE: R69.2 R70.1 ; port EC_ENABLE
ES_ENABLE: R67.2 R68.1 ; port ES_ENABLE
IF_SELECT0: R53.2 R54.1 ; port IF_SELECT0
IF_SELECT1: R51.2 R52.1 ; port IF_SELECT1
IF_SELECT2: R49.2 R50.1 ; port IF_SELECT2
NS_ENABLE: R59.2 R60.1 ; port NS_ENABLE
PARITY_ENABLE: R57.2 R58.1 ; port PARITY_ENABLE
RATE0: R41.2 R42.1 ; port RATE0
RATE1: R39.2 R40.1 ; port RATE1
RATE2: R37.2 R38.1 ; port RATE2
RATE3: R35.2 R36.1 ; port RATE3
RATE4: R33.2 R34.1 ; port RATE4
RATE5: R31.2 R32.1 ; port RATE5
S_COM_RATE0: R47.2 R48.1 ; port S_COM_RATE0
S_COM_RATE1: R45.2 R46.1 ; port S_COM_RATE1
S_COM_RATE2: R43.2 R44.1 ; port S_COM_RATE2
SK_ENABLE: R65.2 R66.1 ; port SK_ENABLE

### Notes on the sheet
- 1
- 0
- companding
- noise suppression
- a-law / u-law
- skew control
- N/C
- (near R66) ?
- Not supported in packet mode
- Title
- Size:
- Date:
- B
- Number:
- Time:
- Revision:
- Sheet
- of
- File:

### Library data of the parts
C24-C40 = Cap SM: as C1 on sheet USB DV Stick 1V1_Sheet1; PackageReference: C0603; PackageDescription: Chip Capacitor; Value: 100nF; Supplier 1: Mouser; Supplier Part Number 1: 81-GRM155R61H104KE9D
R31 R34 R36 R38 R40 R41 R43 R46 R48 R49 R52 R53 R56 R58 R60 R62 R64 R66 = RES SM: as R15 on sheet USB DV Stick 1V1_Sheet1; PackageReference: R0603; PackageDescription: Surface Mount; Value: 10; Supplier 1: Mouser; Supplier Part Number 1: 71-CRCW060310R0FKEAC
R32 R33 R35 R37 R39 R42 R44 R45 R47 R50 R51 R54 R55 R57 R59 R61 R63 R65 R67-R70 = RES SM: Resistor Surface Mount; PackageReference: R0603; PackageDescription: Surface Mount; Value: OPEN; Supplier 1: N/A; Manufacturer: N/A; Supplier Part Number 1: N/A; Manufacturer Part Number: N/A

## Nets that join several sheets
+1V8: USB DV Stick 1V1_Sheet1 (C10.2 U4.12 U4.13 U4.14), USB DV Stick 1V1_Sheet2 (12 pins), USB DV Stick 1V1_Sheet3 (10 pins)
+3V3: USB DV Stick 1V1_Sheet1 (10 pins), USB DV Stick 1V1_Sheet2 (17 pins), USB DV Stick 1V1_Sheet3 (27 pins)
GND: USB DV Stick 1V1_Sheet1 (53 pins), USB DV Stick 1V1_Sheet2 (31 pins), USB DV Stick 1V1_Sheet3 (37 pins)
~{AMBE_RESET}: USB DV Stick 1V1_Sheet1 (U2.6), USB DV Stick 1V1_Sheet2 (5 pins)
~{DVSI CTS}: USB DV Stick 1V1_Sheet1 (R83.2 U2.1 U2.2), USB DV Stick 1V1_Sheet2 (J2.5 R25.1 TP8.1 U6.64)
CP_ENABLE: USB DV Stick 1V1_Sheet2 (U6.8), USB DV Stick 1V1_Sheet3 (R61.2 R62.1)
CP_SELECT: USB DV Stick 1V1_Sheet2 (U6.9), USB DV Stick 1V1_Sheet3 (R63.2 R64.1)
DTX_ENABLE: USB DV Stick 1V1_Sheet2 (U6.5), USB DV Stick 1V1_Sheet3 (R55.2 R56.1)
EC_ENABLE: USB DV Stick 1V1_Sheet2 (U6.120), USB DV Stick 1V1_Sheet3 (R69.2 R70.1)
ES_ENABLE: USB DV Stick 1V1_Sheet2 (U6.119), USB DV Stick 1V1_Sheet3 (R67.2 R68.1)
FTDI_RXD: USB DV Stick 1V1_Sheet1 (R74.2 R77.2 R79.2), USB DV Stick 1V1_Sheet2 (J2.4 R23.1 TP6.1 U6.111)
FTDI_TXD: USB DV Stick 1V1_Sheet1 (R14.1 R73.2 R78.2), USB DV Stick 1V1_Sheet2 (5 pins)
IF_SELECT0: USB DV Stick 1V1_Sheet2 (U6.2), USB DV Stick 1V1_Sheet3 (R53.2 R54.1)
IF_SELECT1: USB DV Stick 1V1_Sheet2 (U6.3), USB DV Stick 1V1_Sheet3 (R51.2 R52.1)
IF_SELECT2: USB DV Stick 1V1_Sheet2 (U6.4), USB DV Stick 1V1_Sheet3 (R49.2 R50.1)
NS_ENABLE: USB DV Stick 1V1_Sheet2 (U6.7), USB DV Stick 1V1_Sheet3 (R59.2 R60.1)
PARITY_ENABLE: USB DV Stick 1V1_Sheet2 (U6.79), USB DV Stick 1V1_Sheet3 (R57.2 R58.1)
RATE0: USB DV Stick 1V1_Sheet2 (U6.126), USB DV Stick 1V1_Sheet3 (R41.2 R42.1)
RATE1: USB DV Stick 1V1_Sheet2 (U6.125), USB DV Stick 1V1_Sheet3 (R39.2 R40.1)
RATE2: USB DV Stick 1V1_Sheet2 (U6.124), USB DV Stick 1V1_Sheet3 (R37.2 R38.1)
RATE3: USB DV Stick 1V1_Sheet2 (U6.123), USB DV Stick 1V1_Sheet3 (R35.2 R36.1)
RATE4: USB DV Stick 1V1_Sheet2 (U6.122), USB DV Stick 1V1_Sheet3 (R33.2 R34.1)
RATE5: USB DV Stick 1V1_Sheet2 (U6.121), USB DV Stick 1V1_Sheet3 (R31.2 R32.1)
S_COM_RATE0: USB DV Stick 1V1_Sheet2 (U6.89), USB DV Stick 1V1_Sheet3 (R47.2 R48.1)
S_COM_RATE1: USB DV Stick 1V1_Sheet2 (U6.90), USB DV Stick 1V1_Sheet3 (R45.2 R46.1)
S_COM_RATE2: USB DV Stick 1V1_Sheet2 (U6.91), USB DV Stick 1V1_Sheet3 (R43.2 R44.1)
SK_ENABLE: USB DV Stick 1V1_Sheet2 (U6.6), USB DV Stick 1V1_Sheet3 (R65.2 R66.1)